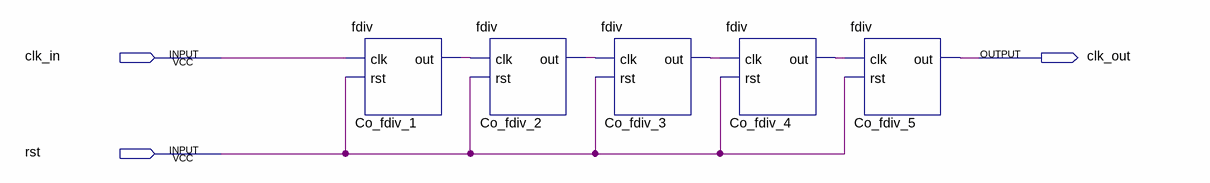
[diagram p0: schematic sheet]
// Quartus schematic fdiv5.bdf as structural Verilog: 5 symbols, 3 pins
module fdiv5 (
  input  clk_in,
  input  rst,
  output clk_out
);

  wire Co_fdiv_1_out, Co_fdiv_2_out, Co_fdiv_3_out, Co_fdiv_4_out;

  fdiv Co_fdiv_1 (.clk(clk_in), .rst(rst), .out(Co_fdiv_1_out));
  fdiv Co_fdiv_2 (.clk(Co_fdiv_1_out), .rst(rst), .out(Co_fdiv_2_out));
  fdiv Co_fdiv_3 (.clk(Co_fdiv_2_out), .rst(rst), .out(Co_fdiv_3_out));
  fdiv Co_fdiv_4 (.clk(Co_fdiv_3_out), .rst(rst), .out(Co_fdiv_4_out));
  fdiv Co_fdiv_5 (.clk(Co_fdiv_4_out), .rst(rst), .out(clk_out));
endmodule
